# Altium schematic sheet WS2812_MATRIX_4.SchDoc
size A4
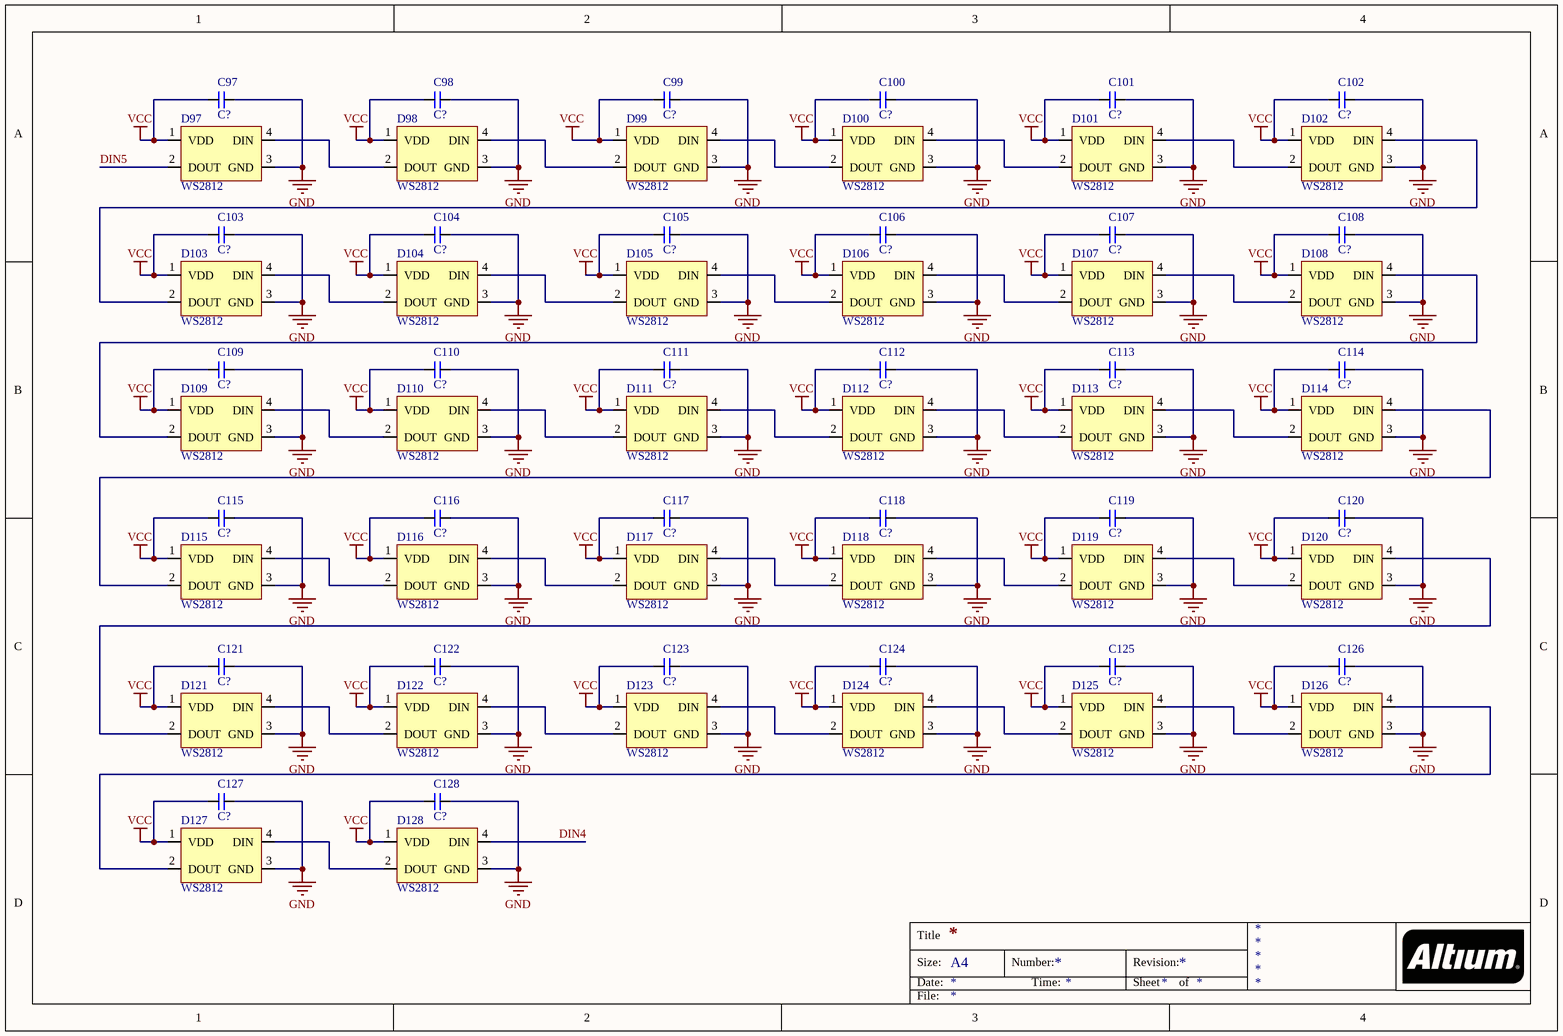
[diagram p0: WS2812_MATRIX_4.SchDoc]

## Parts
C97  C?  [C0603]
C98  C?  [C0603]
C99  C?  [C0603]
C100  C?  [C0603]
C101  C?  [C0603]
C102  C?  [C0603]
C103  C?  [C0603]
C104  C?  [C0603]
C105  C?  [C0603]
C106  C?  [C0603]
C107  C?  [C0603]
C108  C?  [C0603]
C109  C?  [C0603]
C110  C?  [C0603]
C111  C?  [C0603]
C112  C?  [C0603]
C113  C?  [C0603]
C114  C?  [C0603]
C115  C?  [C0603]
C116  C?  [C0603]
C117  C?  [C0603]
C118  C?  [C0603]
C119  C?  [C0603]
C120  C?  [C0603]
C121  C?  [C0603]
C122  C?  [C0603]
C123  C?  [C0603]
C124  C?  [C0603]
C125  C?  [C0603]
C126  C?  [C0603]
C127  C?  [C0603]
C128  C?  [C0603]
D97  WS2812  [WS2812_3528]
D98  WS2812  [WS2812_3528]
D99  WS2812  [WS2812_3528]
D100  WS2812  [WS2812_3528]
D101  WS2812  [WS2812_3528]
D102  WS2812  [WS2812_3528]
D103  WS2812  [WS2812_3528]
D104  WS2812  [WS2812_3528]
D105  WS2812  [WS2812_3528]
D106  WS2812  [WS2812_3528]
D107  WS2812  [WS2812_3528]
D108  WS2812  [WS2812_3528]
D109  WS2812  [WS2812_3528]
D110  WS2812  [WS2812_3528]
D111  WS2812  [WS2812_3528]
D112  WS2812  [WS2812_3528]
D113  WS2812  [WS2812_3528]
D114  WS2812  [WS2812_3528]
D115  WS2812  [WS2812_3528]
D116  WS2812  [WS2812_3528]
D117  WS2812  [WS2812_3528]
D118  WS2812  [WS2812_3528]
D119  WS2812  [WS2812_3528]
D120  WS2812  [WS2812_3528]
D121  WS2812  [WS2812_3528]
D122  WS2812  [WS2812_3528]
D123  WS2812  [WS2812_3528]
D124  WS2812  [WS2812_3528]
D125  WS2812  [WS2812_3528]
D126  WS2812  [WS2812_3528]
D127  WS2812  [WS2812_3528]
D128  WS2812  [WS2812_3528]

## Nets
GND: C97.2 C98.2 C99.2 C100.2 C101.2 C102.2 C103.2 C104.2 C105.2 C106.2 C107.2 C108.2 C109.2 C110.2 C111.2 C112.2 C113.2 C114.2 C115.2 C116.2 C117.2 C118.2 C119.2 C120.2 C121.2 C122.2 C123.2 C124.2 C125.2 C126.2 C127.2 C128.2 D97.3(GND) D98.3(GND) D99.3(GND) D100.3(GND) D101.3(GND) D102.3(GND) D103.3(GND) D104.3(GND) D105.3(GND) D106.3(GND) D107.3(GND) D108.3(GND) D109.3(GND) D110.3(GND) D111.3(GND) D112.3(GND) D113.3(GND) D114.3(GND) D115.3(GND) D116.3(GND) D117.3(GND) D118.3(GND) D119.3(GND) D120.3(GND) D121.3(GND) D122.3(GND) D123.3(GND) D124.3(GND) D125.3(GND) D126.3(GND) D127.3(GND) D128.3(GND)
VCC: C97.1 C98.1 C99.1 C100.1 C101.1 C102.1 C103.1 C104.1 C105.1 C106.1 C107.1 C108.1 C109.1 C110.1 C111.1 C112.1 C113.1 C114.1 C115.1 C116.1 C117.1 C118.1 C119.1 C120.1 C121.1 C122.1 C123.1 C124.1 C125.1 C126.1 C127.1 C128.1 D97.1(VDD) D98.1(VDD) D99.1(VDD) D100.1(VDD) D101.1(VDD) D102.1(VDD) D103.1(VDD) D104.1(VDD) D105.1(VDD) D106.1(VDD) D107.1(VDD) D108.1(VDD) D109.1(VDD) D110.1(VDD) D111.1(VDD) D112.1(VDD) D113.1(VDD) D114.1(VDD) D115.1(VDD) D116.1(VDD) D117.1(VDD) D118.1(VDD) D119.1(VDD) D120.1(VDD) D121.1(VDD) D122.1(VDD) D123.1(VDD) D124.1(VDD) D125.1(VDD) D126.1(VDD) D127.1(VDD) D128.1(VDD)
DIN4: D128.4(DIN)
DIN5: D97.2(DOUT)
NetD97_4: D97.4(DIN) D98.2(DOUT)
NetD98_4: D98.4(DIN) D99.2(DOUT)
NetD99_4: D99.4(DIN) D100.2(DOUT)
NetD100_4: D100.4(DIN) D101.2(DOUT)
NetD101_4: D101.4(DIN) D102.2(DOUT)
NetD102_4: D102.4(DIN) D103.2(DOUT)
NetD103_4: D103.4(DIN) D104.2(DOUT)
NetD104_4: D104.4(DIN) D105.2(DOUT)
NetD105_4: D105.4(DIN) D106.2(DOUT)
NetD106_4: D106.4(DIN) D107.2(DOUT)
NetD107_4: D107.4(DIN) D108.2(DOUT)
NetD108_4: D108.4(DIN) D109.2(DOUT)
NetD109_4: D109.4(DIN) D110.2(DOUT)
NetD110_4: D110.4(DIN) D111.2(DOUT)
NetD111_4: D111.4(DIN) D112.2(DOUT)
NetD112_4: D112.4(DIN) D113.2(DOUT)
NetD113_4: D113.4(DIN) D114.2(DOUT)
NetD114_4: D114.4(DIN) D115.2(DOUT)
NetD115_4: D115.4(DIN) D116.2(DOUT)
NetD116_4: D116.4(DIN) D117.2(DOUT)
NetD117_4: D117.4(DIN) D118.2(DOUT)
NetD118_4: D118.4(DIN) D119.2(DOUT)
NetD119_4: D119.4(DIN) D120.2(DOUT)
NetD120_4: D120.4(DIN) D121.2(DOUT)
NetD121_4: D121.4(DIN) D122.2(DOUT)
NetD122_4: D122.4(DIN) D123.2(DOUT)
NetD123_4: D123.4(DIN) D124.2(DOUT)
NetD124_4: D124.4(DIN) D125.2(DOUT)
NetD125_4: D125.4(DIN) D126.2(DOUT)
NetD126_4: D126.4(DIN) D127.2(DOUT)
NetD127_4: D127.4(DIN) D128.2(DOUT)

## Notes on the sheet
- Title
- Size:
- Date:
- A4
- Number:
- Time:
- Revision:
- Sheet
- of
- File:

## Library data of the parts
C97-C128 = CAP